# Altium schematic sheet BV100011_ControlDI.SchDoc
size A
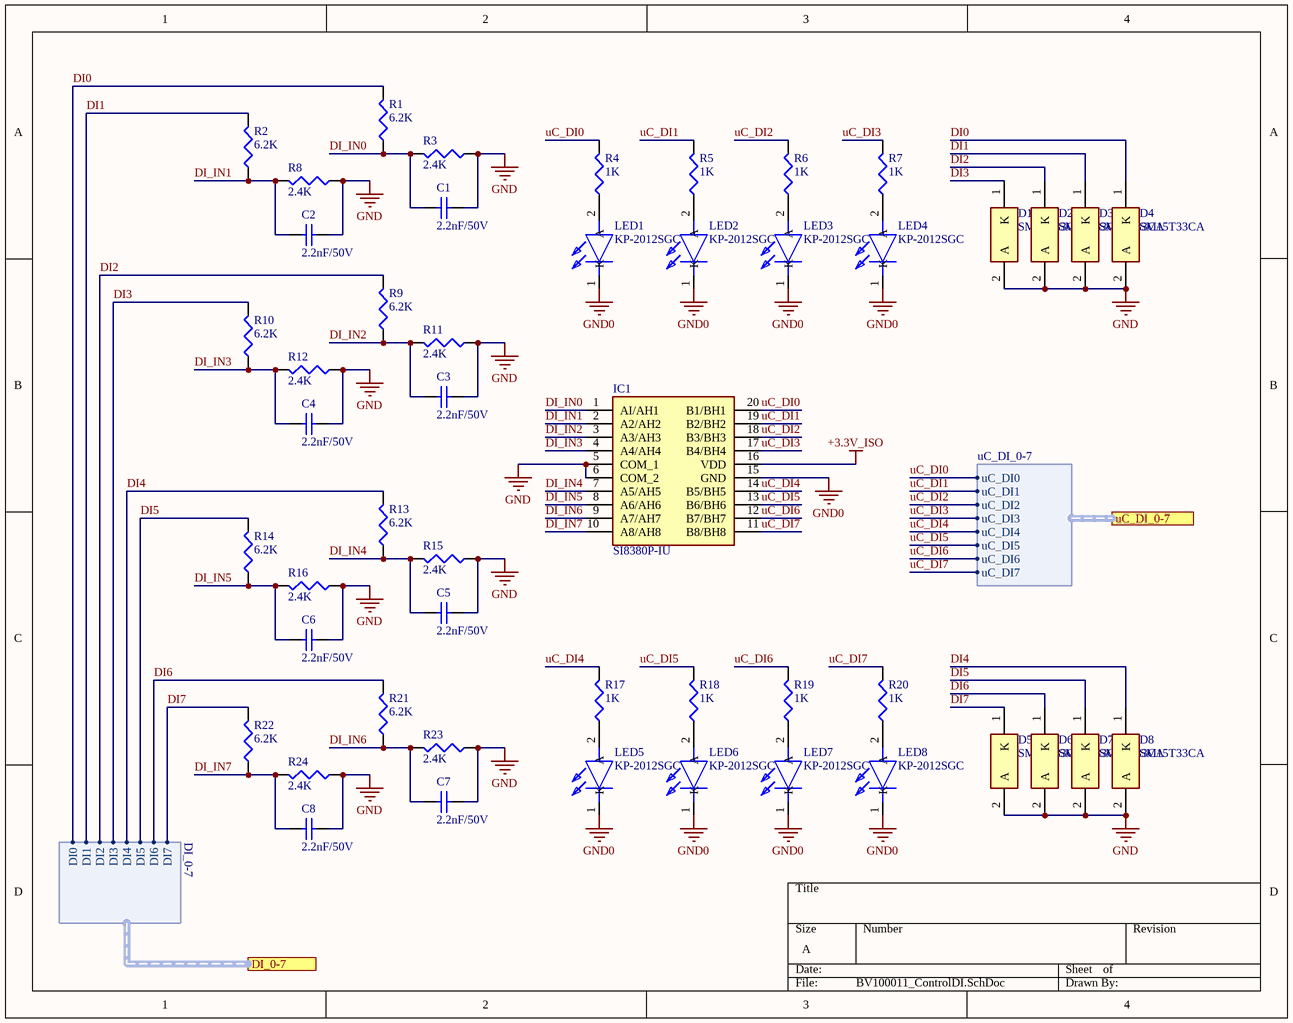
[diagram p0: BV100011_ControlDI.SchDoc]

## Parts
C1  2.2nF/50V  [C1210]
C2  2.2nF/50V  [C1210]
C3  2.2nF/50V  [C1210]
C4  2.2nF/50V  [C1210]
C5  2.2nF/50V  [C1210]
C6  2.2nF/50V  [C1210]
C7  2.2nF/50V  [C1210]
C8  2.2nF/50V  [C1210]
D1  SM15T33CA  [DIONM8059X265N]
D2  SM15T33CA  [DIONM8059X265N]
D3  SM15T33CA  [DIONM8059X265N]
D4  SM15T33CA  [DIONM8059X265N]
D5  SM15T33CA  [DIONM8059X265N]
D6  SM15T33CA  [DIONM8059X265N]
D7  SM15T33CA  [DIONM8059X265N]
D8  SM15T33CA  [DIONM8059X265N]
IC1  SI8380P-IU  [SOP64P600X175-20N]
LED1  KP-2012SGC  [LEDC2012X110N]
LED2  KP-2012SGC  [LEDC2012X110N]
LED3  KP-2012SGC  [LEDC2012X110N]
LED4  KP-2012SGC  [LEDC2012X110N]
LED5  KP-2012SGC  [LEDC2012X110N]
LED6  KP-2012SGC  [LEDC2012X110N]
LED7  KP-2012SGC  [LEDC2012X110N]
LED8  KP-2012SGC  [LEDC2012X110N]
R1  6.2K  [12Z-2010]
R2  6.2K  [12Z-2010]
R3  2.4K  [12Z-2010]
R4  1K  [0402]
R5  1K  [0402]
R6  1K  [0402]
R7  1K  [0402]
R8  2.4K  [12Z-2010]
R9  6.2K  [12Z-2010]
R10  6.2K  [12Z-2010]
R11  2.4K  [12Z-2010]
R12  2.4K  [12Z-2010]
R13  6.2K  [12Z-2010]
R14  6.2K  [12Z-2010]
R15  2.4K  [12Z-2010]
R16  2.4K  [12Z-2010]
R17  1K  [0402]
R18  1K  [0402]
R19  1K  [0402]
R20  1K  [0402]
R21  6.2K  [12Z-2010]
R22  6.2K  [12Z-2010]
R23  2.4K  [12Z-2010]
R24  2.4K  [12Z-2010]

## Ports
DI_0-7 (harness DI_0-7), uC_DI_0-7 (harness uC_DI_0-7)

## Harnesses
DI_0-7: DI0, DI1, DI2, DI3, DI4, DI5, DI6, DI7
uC_DI_0-7: uC_DI0, uC_DI1, uC_DI2, uC_DI3, uC_DI4, uC_DI5, uC_DI6, uC_DI7

## Nets
+3.3V_ISO: IC1.16(VDD)
GND: C1.2 C2.2 C3.2 C4.2 C5.2 C6.2 C7.2 C8.2 D1.2(A) D2.2(A) D3.2(A) D4.2(A) D5.2(A) D6.2(A) D7.2(A) D8.2(A) IC1.5(COM_1) IC1.6(COM_2) R3.1 R8.1 R11.1 R12.1 R15.1 R16.1 R23.1 R24.1
GND0: IC1.15(GND) LED1.1(K) LED2.1(K) LED3.1(K) LED4.1(K) LED5.1(K) LED6.1(K) LED7.1(K) LED8.1(K)
DI0: D4.1(K) R1.2 ; port DI_0-7.DI0
DI1: D3.1(K) R2.2 ; port DI_0-7.DI1
DI2: D2.1(K) R9.2 ; port DI_0-7.DI2
DI3: D1.1(K) R10.2 ; port DI_0-7.DI3
DI4: D8.1(K) R13.2 ; port DI_0-7.DI4
DI5: D7.1(K) R14.2 ; port DI_0-7.DI5
DI6: D6.1(K) R21.2 ; port DI_0-7.DI6
DI7: D5.1(K) R22.2 ; port DI_0-7.DI7
DI_IN0: C1.1 IC1.1(AI/AH1) R1.1 R3.2
DI_IN1: C2.1 IC1.2(A2/AH2) R2.1 R8.2
DI_IN2: C3.1 IC1.3(A3/AH3) R9.1 R11.2
DI_IN3: C4.1 IC1.4(A4/AH4) R10.1 R12.2
DI_IN4: C5.1 IC1.7(A5/AH5) R13.1 R15.2
DI_IN5: C6.1 IC1.8(A6/AH6) R14.1 R16.2
DI_IN6: C7.1 IC1.9(A7/AH7) R21.1 R23.2
DI_IN7: C8.1 IC1.10(A8/AH8) R22.1 R24.2
uC_DI0: IC1.20(B1/BH1) R4.2 ; port uC_DI_0-7.uC_DI0
uC_DI1: IC1.19(B2/BH2) R5.2 ; port uC_DI_0-7.uC_DI1
uC_DI2: IC1.18(B3/BH3) R6.2 ; port uC_DI_0-7.uC_DI2
uC_DI3: IC1.17(B4/BH4) R7.2 ; port uC_DI_0-7.uC_DI3
uC_DI4: IC1.14(B5/BH5) R17.2 ; port uC_DI_0-7.uC_DI4
uC_DI5: IC1.13(B6/BH6) R18.2 ; port uC_DI_0-7.uC_DI5
uC_DI6: IC1.12(B7/BH7) R19.2 ; port uC_DI_0-7.uC_DI6
uC_DI7: IC1.11(B8/BH8) R20.2 ; port uC_DI_0-7.uC_DI7
NetLED1_2: LED1.2(A) R4.1
NetLED2_2: LED2.2(A) R5.1
NetLED3_2: LED3.2(A) R6.1
NetLED4_2: LED4.2(A) R7.1
NetLED5_2: LED5.2(A) R17.1
NetLED6_2: LED6.2(A) R18.1
NetLED7_2: LED7.2(A) R19.1
NetLED8_2: LED8.2(A) R20.1

## Library data of the parts
C1-C8 = Cap Semi: Capacitor (Semiconductor SIM Model); Published: 8-Jun-2000; LatestRevisionDate: 29-May-2009; LatestRevisionNote: IPC-7351 Footprint Added.; PackageReference: C1206; Publisher: Altium Limited; PackageDescription: Chip Capacitor; Value: 2.2nF/50V
D1-D8 = SM15T33CA: Diode; Manufacturer_Name: STMicroelectronics; Allied_Number: 70390412; Datasheet Link: http://www.st.com/web/en/resource/technical/document/datasheet/CD00000724.pdf; Height: 2.65mm; Manufacturer_Part_Number: SM15T33CA; Mouser Part Number: 511-SM15T33CA; Mouser Price/Stock: https://www.mouser.com/Search/Refine.aspx?Keyword=511-SM15T33CA; RS Part Number: 9196428; RS Price/Stock: https://uk.rs-online.com/web/p/products/9196428; Allied Price/Stock: http://www.alliedelec.com/stmicroelectronics-sm15t33ca/70390412/
IC1 = SI8380P-IU: Integrated Circuit; Manufacturer_Name: Silicon Labs; Datasheet Link: https://componentsearchengine.com/Datasheets/1/SI8380P-IU.pdf; Height: 1.75mm; Mouser Part Number: 634-SI8380P-IU; Mouser Price/Stock: https://www.mouser.com/Search/Refine.aspx?Keyword=634-SI8380P-IU; Manufacturer_Part_Number: SI8380P-IU
LED1-LED8 = KP-2012SGC: LED; Manufacturer_Name: Kingbright; Datasheet Link: http://my.rs-online.com/webdocs/032f/0900766b8032fa8b.pdf; Height: 1.1mm; Manufacturer_Part_Number: KP-2012SGC; Mouser Part Number: N/A; Mouser Price/Stock: https://www.mouser.com/Search/Refine.aspx?Keyword=N%2FA; RS Part Number: 4663807; RS Price/Stock: https://uk.rs-online.com/web/p/products/4663807
R1-R24 = Res3: Resistor; Published: 8-Jun-2000; LatestRevisionDate: 29-May-2009; LatestRevisionNote: IPC-7351 Footprint Added.; PackageReference: J1-0603; Publisher: Altium Limited; PackageDescription: Chip Resistor
  R1 R2 R9 R10 R13 R21 R22: Value: 6.2K
  R3 R8 R11 R12 R15 R16 R23 R24: Value: 2.4K
  R4-R7 R17-R20: Value: 1K
  R14: Value: 6.2k